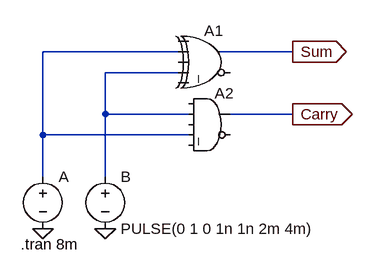
[diagram p0: schematic half adder.asc]
half adder.asc, the LTspice schematic file:
Version 4
SHEET 1 880 680
WIRE 144 -304 -64 -304
WIRE 320 -304 208 -304
WIRE 144 -272 32 -272
WIRE 32 -208 32 -272
WIRE 160 -208 32 -208
WIRE 320 -208 224 -208
WIRE -64 -176 -64 -304
WIRE 160 -176 -64 -176
WIRE -64 -112 -64 -176
WIRE 32 -112 32 -208
FLAG -64 -32 0
FLAG 32 -32 0
FLAG 320 -304 Sum
IOPIN 320 -304 Out
FLAG 320 -208 Carry
IOPIN 320 -208 Out
SYMBOL voltage -64 -128 R0
WINDOW 3 24 96 Invisible 2
WINDOW 123 0 0 Left 0
WINDOW 39 0 0 Left 0
SYMATTR InstName A
SYMATTR Value PULSE(0 1 0 1n 1n 1m 2m)
SYMBOL voltage 32 -128 R0
WINDOW 123 0 0 Left 0
WINDOW 39 0 0 Left 0
SYMATTR InstName B
SYMATTR Value PULSE(0 1 0 1n 1n 2m 4m)
SYMBOL Digital\\xor 192 -352 R0
SYMATTR InstName A1
SYMBOL Digital\\and 192 -256 R0
SYMATTR InstName A2
TEXT -98 -8 Left 2 !.tran 8m

The netlist it stands for:
* half adder.asc
V§A N001 0 PULSE(0 1 0 1n 1n 1m 2m)
V§B N002 0 PULSE(0 1 0 1n 1n 2m 4m)
A1 0 N001 0 N002 0 0 Sum 0 XOR
A2 0 N002 0 N001 0 0 Carry 0 AND
.tran 8m
.backanno
.end